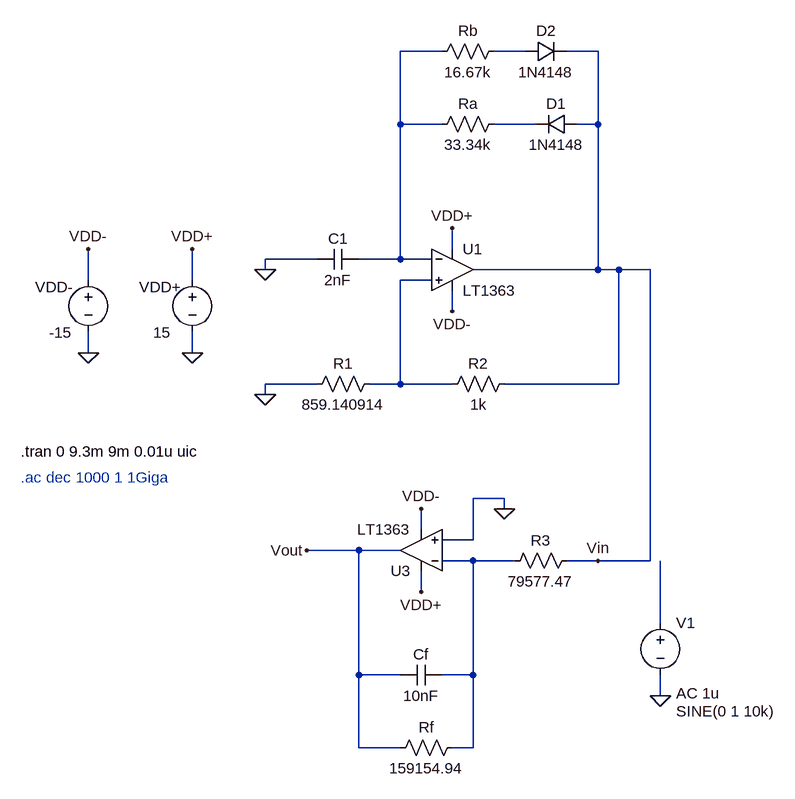
[diagram p0: schematic q4.asc]
q4.asc, the LTspice schematic file:
Version 4.1
SHEET 1 1336 1520
WIRE 176 -176 112 -176
WIRE 304 -176 256 -176
WIRE 416 -176 368 -176
WIRE 112 -64 112 -176
WIRE 176 -64 112 -64
WIRE 320 -64 256 -64
WIRE 416 -64 416 -176
WIRE 416 -64 384 -64
WIRE 192 128 192 96
WIRE -16 144 -96 144
WIRE 112 144 112 -64
WIRE 112 144 48 144
WIRE 160 144 112 144
WIRE -96 160 -96 144
WIRE 416 160 416 -64
WIRE 416 160 224 160
WIRE 448 160 416 160
WIRE 496 160 448 160
WIRE -368 176 -368 128
WIRE -208 176 -208 128
WIRE 160 176 112 176
WIRE 192 224 192 192
WIRE -368 288 -368 256
WIRE -208 288 -208 256
WIRE -16 336 -96 336
WIRE 112 336 112 176
WIRE 112 336 64 336
WIRE 192 336 112 336
WIRE 448 336 448 160
WIRE 448 336 272 336
WIRE -96 352 -96 336
WIRE 272 512 224 512
WIRE 272 528 272 512
WIRE 144 560 144 528
WIRE 224 576 224 512
WIRE 224 576 176 576
WIRE 48 592 -32 592
WIRE 112 592 48 592
WIRE 224 608 176 608
WIRE 288 608 224 608
WIRE 416 608 368 608
WIRE 496 608 496 160
WIRE 496 608 416 608
WIRE 144 656 144 624
WIRE 512 704 512 608
WIRE 48 784 48 592
WIRE 112 784 48 784
WIRE 224 784 224 608
WIRE 224 784 176 784
WIRE 512 816 512 784
WIRE 48 896 48 784
WIRE 112 896 48 896
WIRE 224 896 224 784
WIRE 224 896 192 896
FLAG -368 288 0
FLAG -208 288 0
FLAG -368 128 VDD-
FLAG -208 128 VDD+
FLAG 192 96 VDD+
FLAG 192 224 VDD-
FLAG -96 160 0
FLAG -96 352 0
FLAG 272 528 0
FLAG 144 656 VDD+
FLAG 144 528 VDD-
FLAG 512 816 0
FLAG 416 608 Vin
FLAG -32 592 Vout
SYMBOL voltage -368 160 R0
WINDOW 0 -82 27 Left 2
WINDOW 3 -60 97 Left 2
WINDOW 123 0 0 Left 0
WINDOW 39 0 0 Left 0
SYMATTR InstName VDD-
SYMATTR Value -15
SYMBOL voltage -208 160 R0
WINDOW 0 -82 27 Left 2
WINDOW 3 -60 97 Left 2
WINDOW 123 0 0 Left 0
WINDOW 39 0 0 Left 0
SYMATTR InstName VDD+
SYMATTR Value 15
SYMBOL res 272 -80 R90
WINDOW 0 0 56 VBottom 2
WINDOW 3 32 56 VTop 2
SYMATTR InstName Ra
SYMATTR Value 33.34k
SYMBOL OpAmps\\LT1363 192 96 R0
SYMATTR InstName U1
SYMBOL cap 48 128 R90
WINDOW 0 0 32 VBottom 2
WINDOW 3 32 32 VTop 2
SYMATTR InstName C1
SYMATTR Value 2nF
SYMBOL res 288 320 R90
WINDOW 0 0 56 VBottom 2
WINDOW 3 32 56 VTop 2
SYMATTR InstName R2
SYMATTR Value 1k
SYMBOL res 80 320 R90
WINDOW 0 0 56 VBottom 2
WINDOW 3 32 56 VTop 2
SYMATTR InstName R1
SYMATTR Value 859.140914
SYMBOL res 384 592 R90
WINDOW 0 0 56 VBottom 2
WINDOW 3 32 56 VTop 2
SYMATTR InstName R3
SYMATTR Value 79577.47
SYMBOL OpAmps\\LT1363 144 656 R180
SYMATTR InstName U3
SYMBOL cap 176 768 R90
WINDOW 0 0 32 VBottom 2
WINDOW 3 32 32 VTop 2
SYMATTR InstName Cf
SYMATTR Value 10nF
SYMBOL res 208 880 R90
WINDOW 0 0 56 VBottom 2
WINDOW 3 32 56 VTop 2
SYMATTR InstName Rf
SYMATTR Value 159154.94
SYMBOL voltage 512 688 R0
WINDOW 3 24 152 Left 2
WINDOW 123 24 124 Left 2
WINDOW 39 0 0 Left 0
SYMATTR Value SINE(0 1 10k)
SYMATTR Value2 AC 1u
SYMATTR InstName V1
SYMBOL diode 384 -80 R90
WINDOW 0 0 32 VBottom 2
WINDOW 3 32 32 VTop 2
SYMATTR InstName D1
SYMATTR Value 1N4148
SYMBOL res 272 -192 R90
WINDOW 0 0 56 VBottom 2
WINDOW 3 32 56 VTop 2
SYMATTR InstName Rb
SYMATTR Value 16.67k
SYMBOL diode 304 -160 R270
WINDOW 0 32 32 VTop 2
WINDOW 3 0 32 VBottom 2
SYMATTR InstName D2
SYMATTR Value 1N4148
TEXT -472 440 Left 2 !.tran 0 9.3m 9m 0.01u uic
TEXT -472 480 Left 2 ;.ac dec 1000 1 1Giga

The netlist it stands for:
* q4.asc
VDD- VDD- 0 -15
VDD+ VDD+ 0 15
Ra N003 N001 33.34k
X§U1 N004 N001 VDD+ VDD- Vin LT1363  ; pins In+ In- V+ V- OUT
C1 N001 0 2nF
R2 Vin N004 1k
R1 N004 0 859.140914
R3 Vin N005 79577.47
X§U3 0 N005 VDD+ VDD- Vout LT1363  ; pins In+ In- V+ V- OUT
Cf N005 Vout 10nF
Rf N005 Vout 159154.94
V1 N006 0 SINE(0 1 10k) AC 1u
D1 Vin N003 1N4148
Rb N002 N001 16.67k
D2 N002 Vin 1N4148
.model D D
.lib standard.dio
.tran 0 9.3m 9m 0.01u uic
* .ac dec 1000 1 1Giga
.lib LT1363.sub
.backanno
.end

* Results of the author's LTspice run, read from the files saved beside the schematic
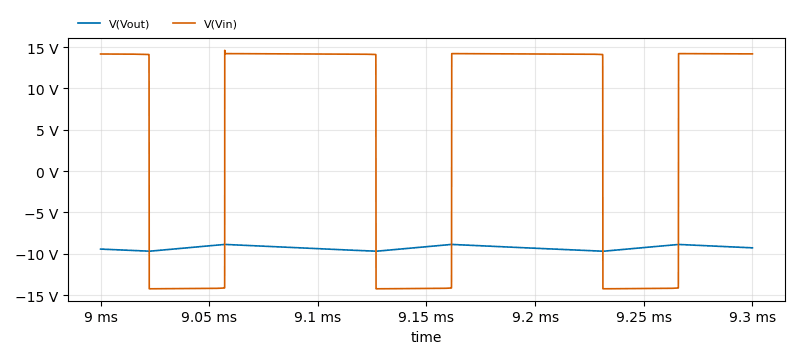
[diagram p1: Transient Analysis of q4.asc, plotted from the saved traces]
* Transient Analysis, 1 run:
*   V(Vout): min -9.706 V, max -8.87 V, average -9.287 V, rms 9.29 V, last -9.287 V
*   V(Vin): min -14.24 V, max 14.6 V, average 4.292 V, rms 14.18 V, last 14.18 V